# Altium schematic sheet vme_can_fpga.SchDoc: =GlobalProjectName
size 410 x 297 mm; SheetNumber: 4; SheetTotal: 7; PageSetup: Record=PageOptions|CenterHorizontal=True|CenterVertical=True|PrintScale=1.00|XCorrection=1.00|YCorrection=1.00|PrintKind=1|BorderSize=5000000|LeftOffset=0|BottomOffset=0|Orientation=2|PaperLength=1000|PaperWidth=1000|Scale=100|PaperSource=15|PrintQuality=1200|MediaType=1|DitherType=10|PaperKind=A3|PrintScaleMode=1; Weight: -; ScaleFactor: -
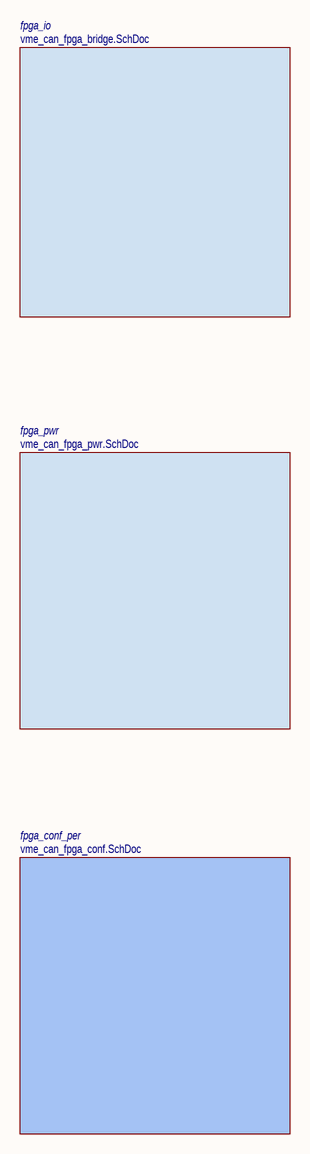
[diagram p0: vme_can_fpga.SchDoc]

## Sub-sheets
fpga_conf_per = vme_can_fpga_conf.SchDoc: no entries
fpga_io = vme_can_fpga_bridge.SchDoc: no entries
fpga_pwr = vme_can_fpga_pwr.SchDoc: no entries

## Notes on the sheet
- Подп. и дата
- Инв. № дубл.
- Взам. инв. №
- Инв. № подл.
- Изм.
- Лист
- № докум.
- Подп.
- Дата
- Форма 2а ГОСТ 2.104-2006
- Копировал
- Формат А3